# Altium schematic sheet PowerStepDown.SchDoc
size 279 x 215 mm
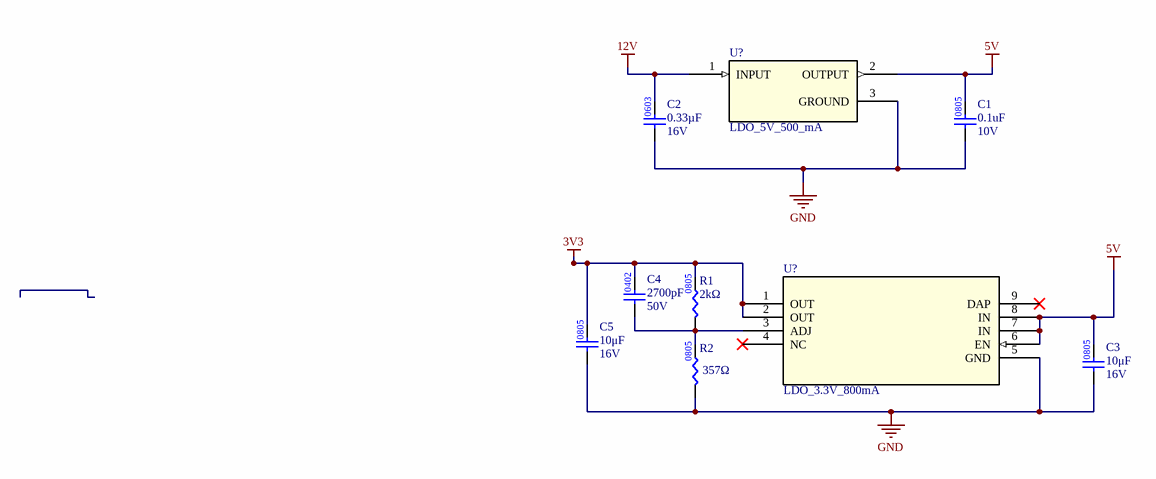
[diagram p0: PowerStepDown.SchDoc]

## Parts
(Parts that share a designator on the sheet are numbered #1, #2 ... from top to bottom, then left to right.)
C1  value 0.1uF  Voltage Rating: 10V  [CAP0805]  (hidden comment: CAP_0.1uF_10V_0805)
C2  value 0.33µF  Voltage Rating: 16V  [CAP0603]  (hidden comment: CAP_0.33uF_16V_0603)
C3  value 10μF  Voltage Rating: 16V  [CAP0805]  (hidden comment: CAP_10uF_16V_0805)
C4  Capacitance: 2700pF  Voltage Rating: 50V  [CAP0402]  (hidden comment: CAP_2700pF_50V_0402)
C5  value 10μF  Voltage Rating: 16V  [CAP0805]  (hidden comment: CAP_10uF_16V_0805)
R1  value 2kΩ  [RES0805]  (hidden comment: RES_2KΩ_0805_1%)
R2  357Ω  [RES0805]
U?#1  LDO_5V_500_mA  [L78M05CDT-TR]
U?#2  LDO_3.3V_800mA  [LP38511MRX-ADJ/NOPB]

## Nets
3V3: C4.2 C5.2 R1.2 U?#2.1(OUT) U?#2.2(OUT)
5V: C1.2 C3.2 U?#1.2(OUTPUT) U?#2.6(EN) U?#2.7(IN) U?#2.8(IN)
12V: C2.2 U?#1.1(INPUT)
GND: C1.1 C2.1 C3.1 C5.1 R2.1 U?#1.3(GROUND) U?#2.5(GND)
NetC4_1: C4.1 R1.1 R2.2 U?#2.3(ADJ)

Not connected (* = marked no-connect by the designer): U?#2 4(NC)* 9(DAP)*

## Notes on the sheet
- University of Waterloo Robotics Team
- 200 University Ave W
- REV
- PROJECT
- Waterloo, Ontario, Canada
- N2L 3G1
- DOCUMENT
- ENGINEER
- REVIEWER
- MODIFIED
- SHEET
- OF
- (in symbol CAP_0.33uF_16V_0603) 0603
- (in symbol CAP_2700pF_50V_0402) 0402
- (in symbol RES_357Ω_0805_1%) 0805

## Library data of the parts
C1 = CAP_0.1uF_10V_0805: CAP CER 0.1uF 10V 0805; Manufacturer 1: KEMET; Manufacturer Part Number 1: C0805C104K8RAC7800; Package/Footprint: 0805; Supplier 1: Digi-Key; Supplier Part Number 1: 399-C0805C104K8RAC7800DKR-ND
C2 = CAP_0.33uF_16V_0603: CAP CER 0.33UF 16V X7R 0603; Manufacturer Part Number 1: GCM188R71C334KA37D; Manufacturer 1: Murata Electronics North America; Supplier Part Number 1: 490-6050-1-ND; Supplier 1: Digi-Key; Dielectric: X7R
C3 C5 = CAP_10uF_16V_0805: CAP CER 10UF 16V X5R 0805; Manufacturer 1: Yageo; Manufacturer Part Number 1: CC0805KKX5R7BB106; Package/Footprint: 0805; Mounting Type: SMD; Supplier 1: Digi-Key; Supplier Part Number 1: 311-1865-1-ND; Dielectric: X5R
C4 = CAP_2700pF_50V_0402: CAP CER 2700PF 50V C0G 0805; Manufacturer 1: TDK Corporation; Manufacturer Part Number 1: C2012C0G1H272J060AA; Package: 0805; Supplier 1: Digi-Key; Supplier Part Number 1: 445-7508-1-ND
R1 = RES_2KΩ_0805_1%: RES 2K OHM 1% 1/8W 0805; Manufacturer 1: YAGEO; Manufacturer Part Number 1: CRCW08052K20JNEAC; Supplier 1: Digi-Key; Supplier Part Number 1: 13-RC0805FR-132KLCT-ND; Tolerance: 1%; Package: 0805
R2 = RES_357Ω_0805_1%: RES 357K OHM 1% 1/16W 0805